# EAGLE schematic igv_NEW (EAGLE 9.5.2)
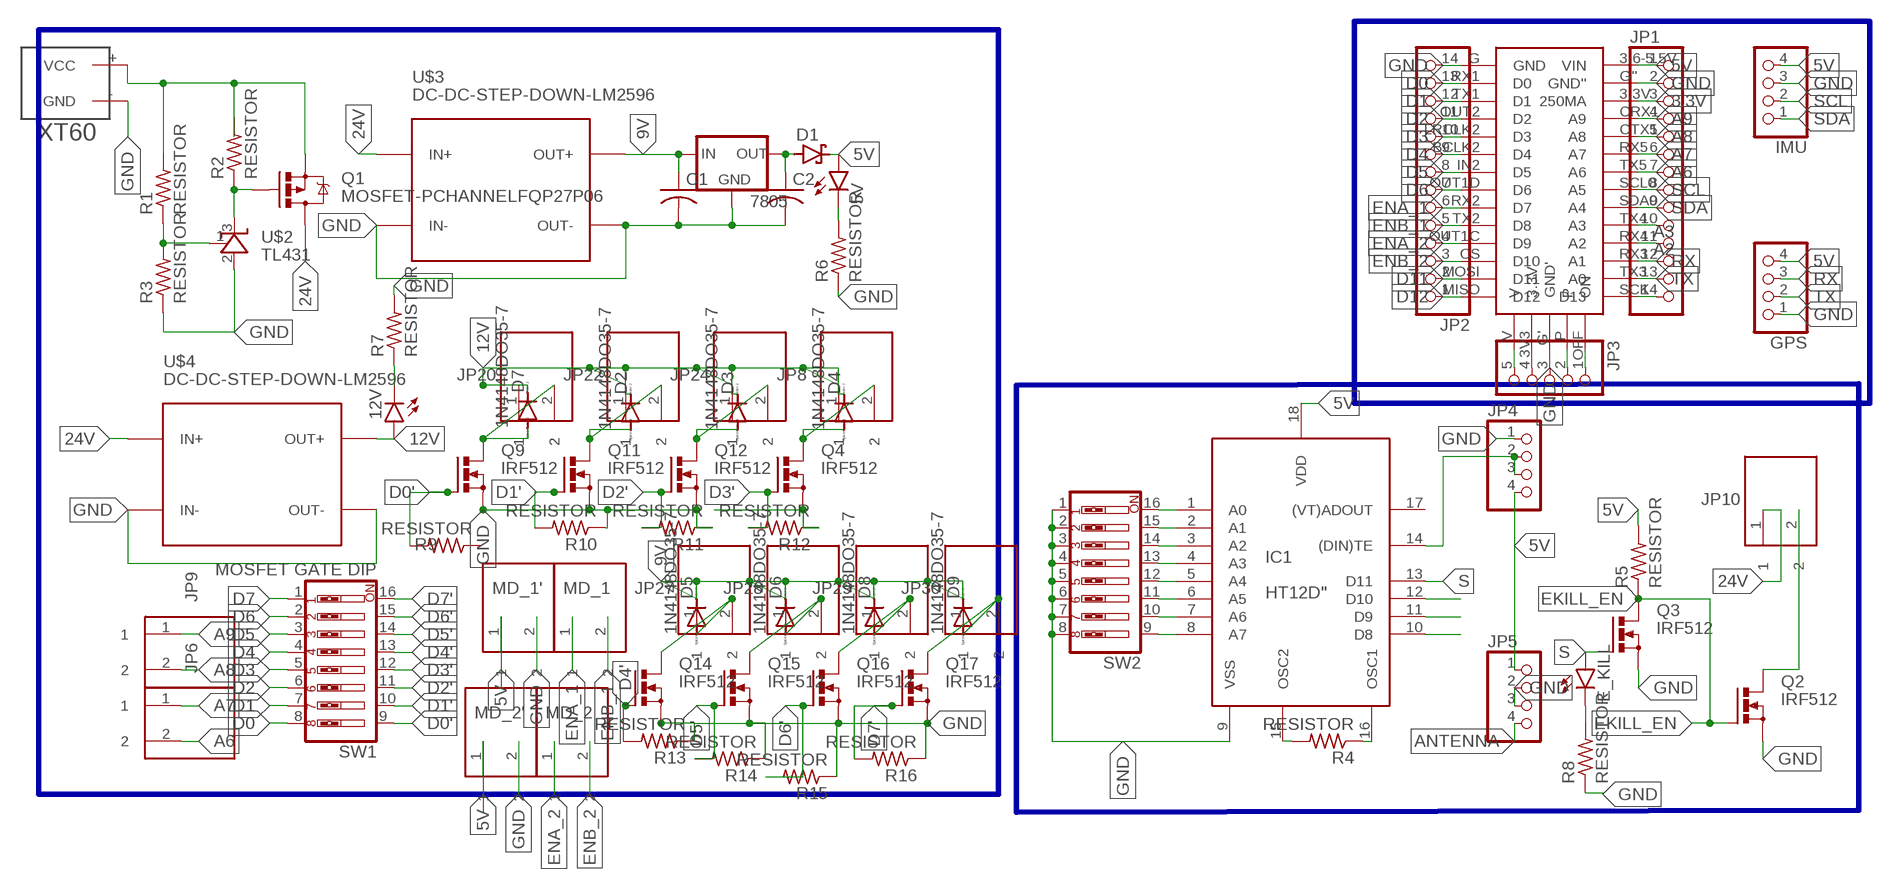
[diagram p0: schematic, sheet 1]

## Parts
5V  LED3MM  [LED3MM]
12V  LED3MM  [LED3MM]
7805  78XXS  [78XXS]
C1  C-US025-025X050  [C025-025X050]
C2  C-US025-025X050  [C025-025X050]
D1  SCHOTTKY-DIODECB417-15  [CB417-15]
D2  1N4148DO35-7  [DO35-7]
D3  1N4148DO35-7  [DO35-7]
D4  1N4148DO35-7  [DO35-7]
D5  1N4148DO35-7  [DO35-7]
D6  1N4148DO35-7  [DO35-7]
D7  1N4148DO35-7  [DO35-7]
D8  1N4148DO35-7  [DO35-7]
D9  1N4148DO35-7  [DO35-7]
E_KILL  LED3MM  [LED3MM]
GPS  ROTARY_ENCODER  PINHD-1X4  [1X04]
IC1  HT12D"  [18-DIP-A]
IMU  ROTARY_ENCODER  PINHD-1X4  [1X04]
JP1  PINHD-1X14  [1X14]
JP2  PINHD-1X14  [1X14]
JP3  PINHD-1X5  [1X05]
JP4  PINHD-1X4  [1X04]
JP5  PINHD-1X4  [1X04]
JP6  O/P_HEADER  [O/P_HEADER]
JP8  O/P_HEADER  [O/P_HEADER]
JP9  O/P_HEADER  [O/P_HEADER]
JP10  O/P_HEADER  [O/P_HEADER]
JP20  O/P_HEADER  [O/P_HEADER]
JP22  O/P_HEADER  [O/P_HEADER]
JP24  O/P_HEADER  [O/P_HEADER]
JP27  O/P_HEADER  [O/P_HEADER]
JP28  O/P_HEADER  [O/P_HEADER]
JP29  O/P_HEADER  [O/P_HEADER]
JP30  O/P_HEADER  [O/P_HEADER]
MD_1  O/P_HEADER  [O/P_HEADER]
MD_1'  O/P_HEADER  [O/P_HEADER]
MD_2  O/P_HEADER  [O/P_HEADER]
MD_2'  O/P_HEADER  [O/P_HEADER]
Q1  MOSFET-PCHANNELFQP27P06  [TO220V]
Q2  IRF512  [TO220BV]
Q3  IRF512  [TO220BV]
Q4  IRF512  [TO220BV]
Q9  IRF512  [TO220BV]
Q11  IRF512  [TO220BV]
Q12  IRF512  [TO220BV]
Q14  IRF512  [TO220BV]
Q15  IRF512  [TO220BV]
Q16  IRF512  [TO220BV]
Q17  IRF512  [TO220BV]
R1  RESISTOR  [0207/10]
R2  RESISTOR  [0207/10]
R3  RESISTOR  [0207/10]
R4  RESISTOR  [0207/10]
R5  RESISTOR  [0207/10]
R6  RESISTOR  [0207/10]
R7  RESISTOR  [0207/10]
R8  RESISTOR  [0207/10]
R9  RESISTOR  [0207/10]
R10  RESISTOR  [0207/10]
R11  RESISTOR  [0207/10]
R12  RESISTOR  [0207/10]
R13  RESISTOR  [0207/10]
R14  RESISTOR  [0207/10]
R15  RESISTOR  [0207/10]
R16  RESISTOR  [0207/10]
SW1  MOSFET GATE DIP  SW_DIP-8  [EDG-08]
SW2  SW_DIP-8  [EDG-08]
U$1  TEENSY_4.0  [TEENSY_4.0]
U$2  TL431  [TO-92]
U$3  DC-DC-STEP-DOWN-LM2596  [DC-DC-STEP-DOWN-LM2596]
U$4  DC-DC-STEP-DOWN-LM2596  [DC-DC-STEP-DOWN-LM2596]
U$5  XT60  [XT60]

## Nets
3.3V: JP1.3 U$1.3.3V(250MA)
5V: 5V.A D1.C GPS.4 IC1.18(VDD) IMU.4 JP1.1 JP4.4 JP5.1 MD_1'.1 MD_2'.1 R5.P$2 U$1.3.6-5.5V(VIN)
9V: 7805.IN C1.1 D5.C D6.C D8.C D9.C JP27.1 JP28.1 JP29.1 JP30.1 U$3.OUT+
12V: 12V.A D2.C D3.C D4.C D7.C JP8.1 JP20.1 JP22.1 JP24.1 U$4.OUT+
24V: JP10.1 Q1.2(D) U$3.IN+ U$4.IN+
A2: JP1.11 U$1.RX4(A2)
A3: JP1.10 U$1.TX4(A3)
A6: JP1.7 JP6.2 U$1.TX5(A6)
A7: JP1.6 JP6.1 U$1.RX5(A7)
A8: JP1.5 JP9.2 U$1.CTX1(A8)
A9: JP1.4 JP9.1 U$1.CRX1(A9)
ANTENNA: JP5.4
D0: JP2.13 SW1.8 U$1.RX1(D0)
D0': Q9.G R9.P$2 SW1.9
D1: JP2.12 SW1.7 U$1.TX1(D1)
D1': Q11.G R10.P$2 SW1.10
D2: JP2.11 SW1.6 U$1.OUT2(D2)
D2': Q12.G R11.P$2 SW1.11
D3: JP2.10 SW1.5 U$1.LRCLK2(D3)
D3': Q4.G R12.P$2 SW1.12
D4: JP2.9 SW1.4 U$1.BCLK2(D4)
D4': Q14.G R13.P$2 SW1.13
D5: JP2.8 SW1.3 U$1.IN2(D5)
D5': Q15.G R14.P$2 SW1.14
D6: JP2.7 SW1.2 U$1.OUT1D(D6)
D6': Q16.G R15.P$2 SW1.15
D7: SW1.1
D7': Q17.G R16.P$2 SW1.16
D11: JP2.2 U$1.MOSI(D11)
D12: JP2.1 U$1.MISO(D12)
EKILL_EN: Q2.G Q3.D R5.P$1
ENA_1: JP2.6 MD_1.1 U$1.RX2(D7)
ENA_2: JP2.4 MD_2.1 U$1.OUT1C(D9)
ENB_1: JP2.5 MD_1.2 U$1.TX2(D8)
ENB_2: JP2.3 MD_2.2 U$1.CS(D10)
GND: 7805.GND C1.2 C2.2 GPS.1 IC1.9(VSS) IMU.3 JP1.2 JP2.14 JP3.3 JP4.1 JP5.2 JP5.3 MD_1'.2 MD_2'.2 Q2.S Q3.S Q9.S Q11.S Q12.S Q14.S Q15.S Q16.S Q17.S R3.P$1 R6.P$1 R7.P$2 R8.P$1 R10.P$1 R11.P$1 R13.P$1 R14.P$1 R15.P$1 R16.P$1 SW2.1 SW2.2 SW2.3 SW2.4 SW2.5 SW2.6 SW2.7 SW2.8 U$1.G''(GND'') U$1.G'(GND') U$1.G(GND) U$2.2(A) U$3.IN- U$3.OUT- U$4.IN- U$4.OUT- U$5.-(GND)
GND1: Q4.S R12.P$1
N$1: Q1.3(S) R1.P$2 R2.P$2 U$5.+(VCC)
N$2: D7.A JP20.2 Q9.D
N$3: IC1.15(OSC2) R4.P$2
N$4: R1.P$1 R3.P$2 U$2.1(REF)
N$5: 5V.K(C) R6.P$2
N$6: E_KILL.K(C) R8.P$2
N$7: JP10.2 Q2.D
N$8: 12V.K(C) R7.P$1
N$9: IC1.16(OSC1) R4.P$1
N$10: Q1.1(G) R2.P$1 U$2.3(C)
N$11: 7805.OUT C2.1 D1.A
N$12: D4.A JP8.2
N$13: Q4.D
N$15: IC1.12(D10)
N$16: IC1.11(D9)
N$19: JP1.14 U$1.SCK(D13)
N$20: IC1.10(D8)
N$24: D2.A JP22.2 Q11.D
N$27: D3.A JP24.2 Q12.D
N$31: D5.A JP27.2 Q14.D
N$33: D6.A JP28.2 Q15.D
N$34: JP3.1 U$1.OFF(ON)
N$35: JP3.2 U$1.P
N$37: JP3.4 U$1.3V3(3.3V)
N$38: JP3.5 U$1.V
N$39: IC1.8(A7) SW2.9
N$40: IC1.7(A6) SW2.10
N$41: IC1.6(A5) SW2.11
N$42: IC1.5(A4) SW2.12
N$43: IC1.4(A3) SW2.13
N$44: IC1.3(A2) SW2.14
N$45: IC1.2(A1) SW2.15
N$46: IC1.1(A0) SW2.16
N$55: IC1.14((DIN)TE) JP4.2 JP4.3
N$58: D8.A JP29.2 Q16.D
N$60: D9.A JP30.2 Q17.D
RX: GPS.3 JP1.12 U$1.RX3(A1)
S: E_KILL.A IC1.13(D11) Q3.G
SCL: IMU.2 JP1.8 U$1.SCL0(A5)
SDA: IMU.1 JP1.9 U$1.SDA0(A4)
TX: GPS.2 JP1.13 U$1.TX3(A0)
Unconnected: IC1.17((VT)ADOUT) R9.P$1

## Library data of the parts
5V 12V E_KILL = led:LED: LED OSRAM: - CHIPLED LG R971, LG N971, LY N971, LG Q971, LY Q971, LO R971, LY R971 LH N974, LH R974 LS Q976, LO Q976, LY Q976 LO Q996 - Hyper CHIPLED LW Q18S LB Q993, LB Q99A, LB R99A - SideLED LS A670, LO A670, LY A670, LG A670, LP A670 LB A673, LV A673, LT A673, LW A673 LH A674 LY A675 LS A676, LA A676, LO A676, LY A676, LW A676 LS A679, LY A679, LG A679 - Hyper Micro SIDELED® LS Y876, LA Y876, LO Y876, LY Y876 LT Y87S - SmartLED LW L88C, LW L88S LB L89C, LB L89S, LG L890 LS L89K, LO L89K, LY L89K LS L896, LA L896, LO L896, LY L896 - TOPLED LS T670, LO T670, LY T670, LG T670, LP T670 LSG T670, LSP T670, LSY T670, LOP T670, LYG T670 LG T671, LOG T671, LSG T671 LB T673, LV T673, LT T673, LW T673 LH T674 LS T676, LA T676, LO T676, LY T676, LB T676, LH T676, LSB T676, LW T676 LB T67C, LV T67C, LT T67C, LS T67K, LO T67K, LY T67K, LW E67C LS E67B, LA E67B, LO E67B, LY E67B, LB E67C, LV E67C, LT E67C LW T67C LS T679, LY T679, LG T679 LS T770, LO T770, LY T770, LG T770, LP T770 LB T773, LV T773, LT T773, LW T773 LH T774 LS E675, LA E675, LY E675, LS T675 LS T776, LA T776, LO T776, LY T776, LB T776 LHGB T686 LT T68C, LB T68C - Hyper Mini TOPLED® LB M676 - Mini TOPLED Santana® LG M470 LS M47K, LO M47K, LY M47K Source: http://www.osram.convergy.de LUXEON: - LUMILED® LXK2-PW12-R00, LXK2-PW12-S00, LXK2-PW14-U00, LXK2-PW14-V00 LXK2-PM12-R00, LXK2-PM12-S00, LXK2-PM14-U00 LXK2-PE12-Q00, LXK2-PE12-R00, LXK2-PE12-S00, LXK2-PE14-T00, LXK2-PE14-U00 LXK2-PB12-K00, LXK2-PB12-L00, LXK2-PB12-M00, LXK2-PB14-N00, LXK2-PB14-P00, LXK2-PB14-Q00 LXK2-PR12-L00, LXK2-PR12-M00, LXK2-PR14-Q00, LXK2-PR14-R00 LXK2-PD12-Q00, LXK2-PD12-R00, LXK2-PD12-S00 LXK2-PH12-R00, LXK2-PH12-S00 LXK2-PL12-P00, LXK2-PL12-Q00, LXK2-PL12-R00 Source: www.luxeon.com KINGBRIGHT: KA-3528ASYC Source: www.kingbright.com
7805 = v-reg:78XXS: VOLTAGE REGULATOR
C1 C2 = rcl:C-US: CAPACITOR, American symbol; SPICEPREFIX: C
D1 = diode:SCHOTTKY-DIODE: Schottky Diode
D2-D9 = diode:1N4148: DIODE high speed (Philips)
GPS IMU JP4 JP5 = pinhead:PINHD-1X4: PIN HEADER
IC1 = holtek:HT12D: decoder = receiver ic
JP1 JP2 = pinhead:PINHD-1X14: PIN HEADER
JP3 = pinhead:PINHD-1X5: PIN HEADER
JP6 JP8-JP10 JP20 JP22 JP24 JP27-JP30 MD_1 MD_1' MD_2 MD_2' = headpins:O/P_HEADER
Q1 = SparkFun-DiscreteSemi:MOSFET-PCHANNEL: Generic PMOSFET IRLML2244 - TRANS-11153 (SOT-23 -20V -4.3A) (1.Gate 2.Source 3.Drain) FQP27P06 - COM-10349 <http://www.sparkfun.com/products/10349> (TO-220 -60V -27A) (1.Gate 2.Source 3.Drain)
Q2-Q4 Q9 Q11 Q12 Q14-Q17 = transistor-power:IRF512: N-CHANNEL MOS FET
R1-R16 = Resistor:RESISTOR
SW1 SW2 = special:SW_DIP-8: DIP SWITCH
U$1 = TEENSY_4.0:TEENSY_4.0
U$2 = GuShH:TL431
U$3 U$4 = diy-modules1:DC-DC-STEP-DOWN-LM2596: DC/DC Step-Down Regulator based on LM2596-ADJ chip LM2596 datasheet available here: http://www.ti.com/lit/ds/symlink/lm2596.pdf Click here to find device on ebay.com <http://www.ebay.com/sch/lm2596+power+regulator>
U$5 = XT60:XT60: XT60